# Altium schematic sheet Sheet2.SchDoc
size C; SheetNumber: 1; SheetTotal: 1; SPICEModelCacheQXJCFWAR: <root> / <DocumentId>QXJCFWAR</DocumentId> / <CacheFrame Number="0"> / <Model Name="0603_885012106029_2.2uf" Kind="CKT"> / <Text>******* / .subckt 0603_885012106029_2.2uF 1 2 / Rser 1 3 0.011 / Lser 2 4 0.0000000008 / C1 3 4 0.0000022 / Rpar 3 4 50000000 / .ends 0603_885012106029_2.2uF</Text> / </Model> / <Model Name="npn" Kind="MDL"> / <Text>*Default NPN BJT / *NPN Trans Pinout: C,B,E / .MODEL NPN NPN()</Text> / </Model> / <Model Name="0603_150060rs75003" Kind="CKT"> / <Text>****** / .subckt 0603_150060RS75003  1  2 / D1 1 2 SMCW / .MODEL SMCW D / + IS=1.0025E-15 / + N=2.2259 / + RS=.3926 / + IKF=240.91E-6 / + CJO=1.0000E-12 / + M=.3333 / + VJ=.75 / + BV=5 / + IBV=10.00E-6 / + TT=5.0000E-9 / .ends</Text> / </Model> / </CacheFrame> / </root>
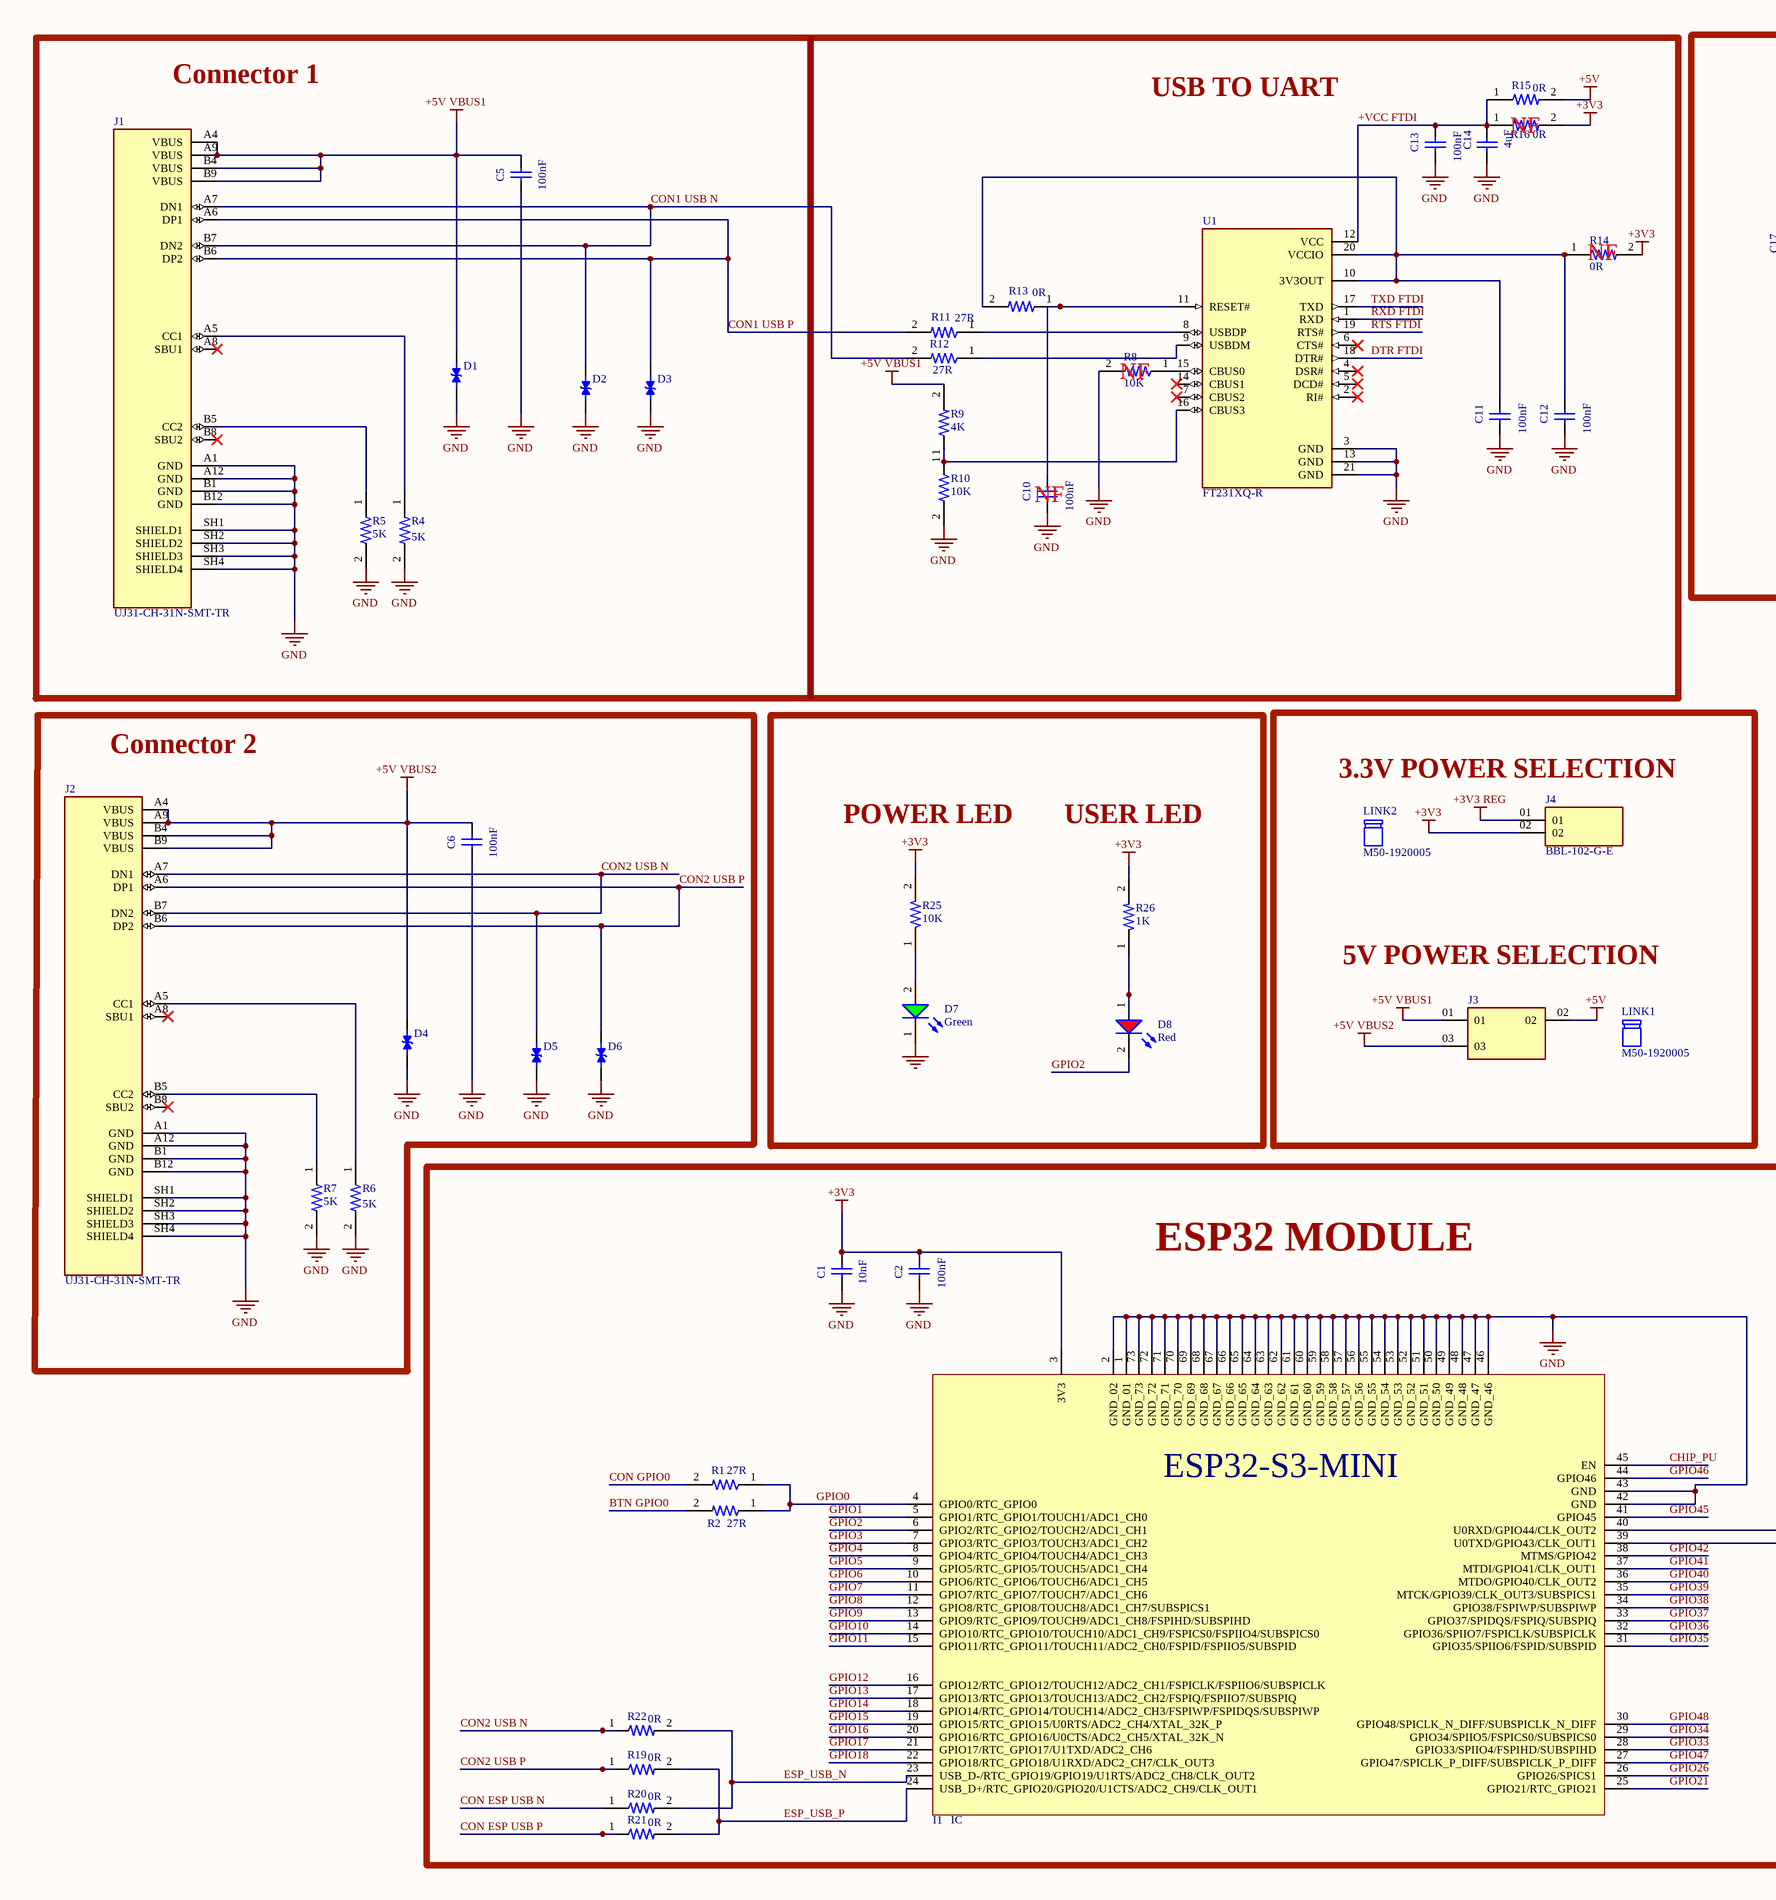
[diagram p0: Sheet2.SchDoc, left]
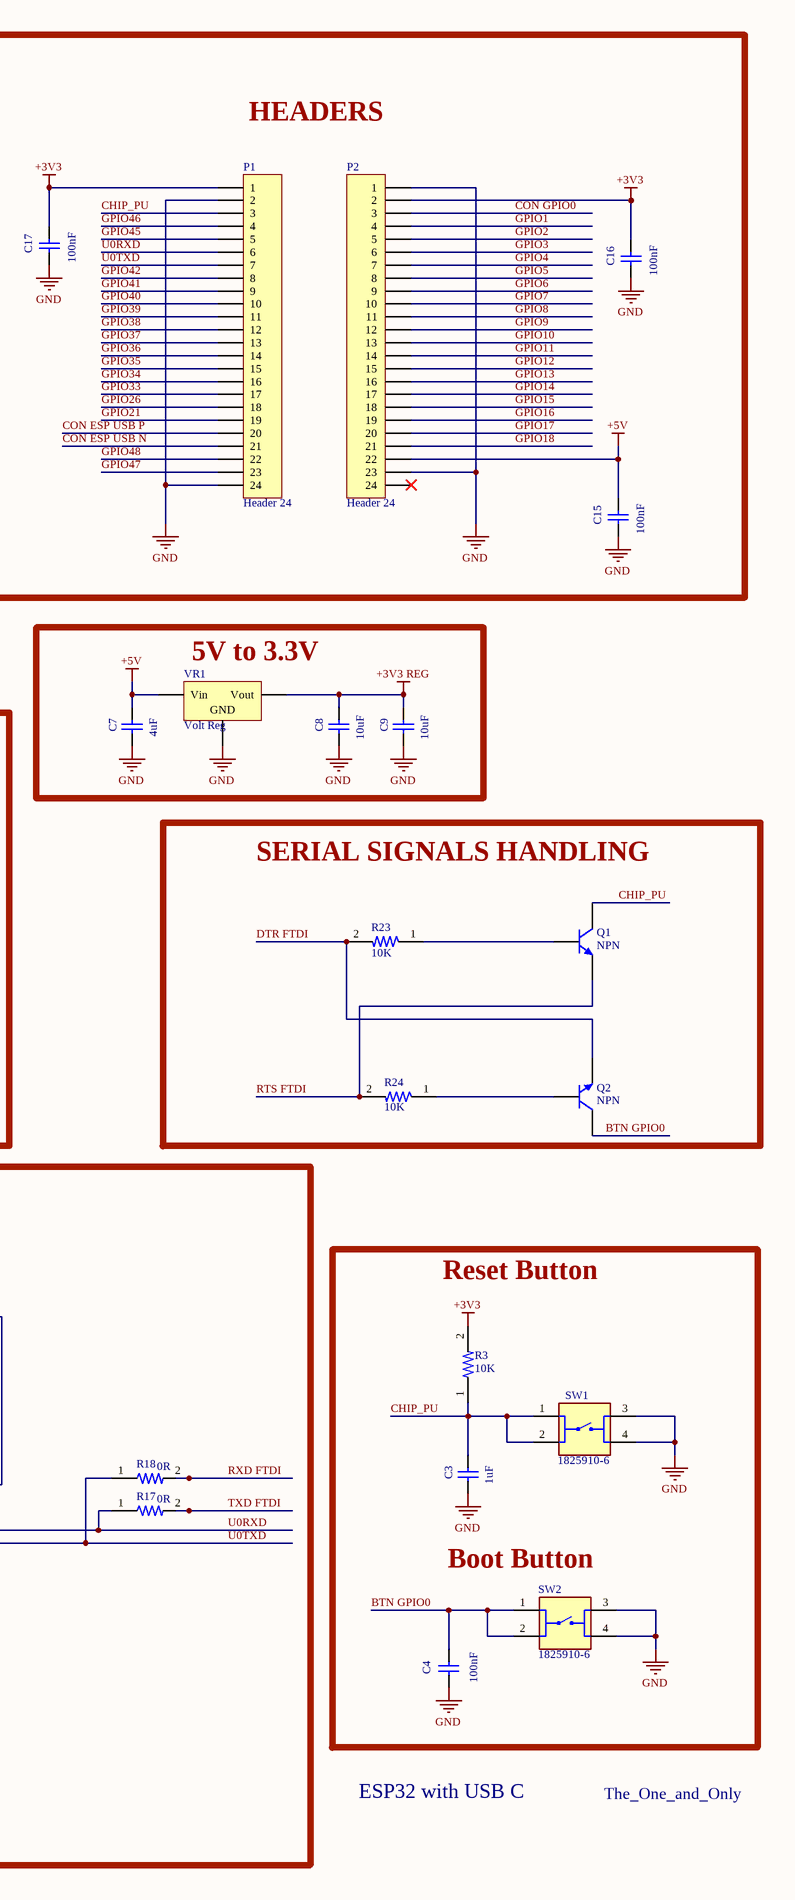
[diagram p1: Sheet2.SchDoc, right]

## Parts
C1  10nF  [WCAP-CSGP_0603_L1.6W0.8H0.8_Reflow]
C2  100nF  [WCAP-CSGP_0603_L1.6W0.8H0.8_Reflow]
C3  1uF  [WCAP-CSGP_0603_L1.6W0.8H0.8_Reflow]
C4  100nF  [WCAP-CSGP_0603_L1.6W0.8H0.8_Reflow]
C5  100nF  [WCAP-CSGP_0603_L1.6W0.8H0.8_Reflow]
C6  100nF  [WCAP-CSGP_0603_L1.6W0.8H0.8_Reflow]
C7  4uF  [WCAP-CSGP_0603_L1.6W0.8H0.8_Reflow]
C8  10uF  [WCAP-CSGP_0603_L1.6W0.8H0.8_Reflow]
C9  10uF  [WCAP-CSGP_0603_L1.6W0.8H0.8_Reflow]
C10  100nF  [WCAP-CSGP_0603_L1.6W0.8H0.8_Reflow]
C11  100nF  [WCAP-CSGP_0603_L1.6W0.8H0.8_Reflow]
C12  100nF  [WCAP-CSGP_0603_L1.6W0.8H0.8_Reflow]
C13  100nF  [WCAP-CSGP_0603_L1.6W0.8H0.8_Reflow]
C14  4uF  [WCAP-CSGP_0603_L1.6W0.8H0.8_Reflow]
C15  100nF  [WCAP-CSGP_0603_L1.6W0.8H0.8_Reflow]
C16  100nF  [WCAP-CSGP_0603_L1.6W0.8H0.8_Reflow]
C17  100nF  [WCAP-CSGP_0603_L1.6W0.8H0.8_Reflow]
D1  TESDU12VRGG  [DIO_TESDU12VRGG]  (value not drawn)
D2  TESDU12VRGG  [DIO_TESDU12VRGG]  (value not drawn)
D3  TESDU12VRGG  [DIO_TESDU12VRGG]  (value not drawn)
D4  TESDU12VRGG  [DIO_TESDU12VRGG]  (value not drawn)
D5  TESDU12VRGG  [DIO_TESDU12VRGG]  (value not drawn)
D6  TESDU12VRGG  [DIO_TESDU12VRGG]  (value not drawn)
D7  Green  [WL-SMCW_0603_150060xx83000]
D8  Red  [WL-SMCW_0603_150060xx75003]
I1  IC  [XCVR_ESP32-MINI-1-N4]
J1  UJ31-CH-31N-SMT-TR  [CUI_UJ31-CH-31N-SMT-TR]
J2  UJ31-CH-31N-SMT-TR  [CUI_UJ31-CH-31N-SMT-TR]
J3  TSW-101-23-S-T  [SAMTEC_TSW-101-23-S-T]  (value not drawn)
J4  BBL-102-G-E  [SAMTEC_BBL-102-G-E]
LINK1  M50-1920005  (mechanical)
LINK2  M50-1920005  (mechanical)
P1  Header 24  [HDR1X24]
P2  Header 24  [HDR1X24]
Q1  NPN  [TO-226-AA]
Q2  NPN  [TO-226-AA]
R1  27R  [RESC1608X50N_CPF0603F10KC1]
R2  27R  [RESC1608X50N_CPF0603F10KC1]
R3  10K  [RESC1608X50N_CPF0603F10KC1]
R4  5K  [RESC1608X50N_CPF0603F10KC1]
R5  5K  [RESC1608X50N_CPF0603F10KC1]
R6  5K  [RESC1608X50N_CPF0603F10KC1]
R7  5K  [RESC1608X50N_CPF0603F10KC1]
R8  10K  [RESC1608X50N_CPF0603F10KC1]
R9  4K  [RESC1608X50N_CPF0603F10KC1]
R10  10K  [RESC1608X50N_CPF0603F10KC1]
R11  27R  [RESC1608X50N_CPF0603F10KC1]
R12  27R  [RESC1608X50N_CPF0603F10KC1]
R13  0R  [RESC1608X50N_CPF0603F10KC1]
R14  0R  [RESC1608X50N_CPF0603F10KC1]
R15  0R  [RESC1608X50N_CPF0603F10KC1]
R16  0R  [RESC1608X50N_CPF0603F10KC1]
R17  0R  [RESC1608X50N_CPF0603F10KC1]
R18  0R  [RESC1608X50N_CPF0603F10KC1]
R19  0R  [RESC1608X50N_CPF0603F10KC1]
R20  0R  [RESC1608X50N_CPF0603F10KC1]
R21  0R  [RESC1608X50N_CPF0603F10KC1]
R22  0R  [RESC1608X50N_CPF0603F10KC1]
R23  10K  [RESC1608X50N_CPF0603F10KC1]
R24  10K  [RESC1608X50N_CPF0603F10KC1]
R25  10K  [RESC1608X50N_CPF0603F10KC1]
R26  1K  [RESC1608X50N_CPF0603F10KC1]
SW1  1825910-6  [SW_1825910-6-4]
SW2  1825910-6  [SW_1825910-6-4]
U1  FT231XQ-R  [QFN50P400X400X80-21N]
VR1  Volt Reg  [D2PAK_N]

## Blocks framed on the sheet
HEADERS: C15-C17 P1 P2
5V to 3.3V: C7-C9 VR1
Connector 2: C6 D4-D6 J2 R6 R7
SERIAL SIGNALS HANDLING: Q1 Q2 R23 R24
ESP32 MODULE: C1 C2 I1 R1 R2 R17-R22

## Nets
+3V3: C1.2 C2.2 C16.2 C17.2 I1.3(3V3) J4.02 P1.1 P2.2 R3.2 R14.2 R16.2 R25.2 R26.2
+3V3 REG: C8.2 C9.2 J4.01 VR1.3(Vout)
+5V: C7.2 C15.2 J3.02 P2.22 R15.2 VR1.1(Vin)
+5V VBUS1: C5.2 D1.2 J1.A4(VBUS) J1.A9(VBUS) J1.B4(VBUS) J1.B9(VBUS) J3.01 R9.2
+5V VBUS2: C6.2 D4.2 J2.A4(VBUS) J2.A9(VBUS) J2.B4(VBUS) J2.B9(VBUS) J3.03
GND: C1.1 C2.1 C3.1 C4.1 C5.1 C6.1 C7.1 C8.1 C9.1 C10.1 C11.1 C12.1 C13.1 C14.1 C15.1 C16.1 C17.1 D1.1 D2.1 D3.1 D4.1 D5.1 D6.1 D7.1(K) I1.1(GND_01) I1.2(GND_02) I1.42(GND) I1.43(GND) I1.46(GND_46) I1.47(GND_47) I1.48(GND_48) I1.49(GND_49) I1.50(GND_50) I1.51(GND_51) I1.52(GND_52) I1.53(GND_53) I1.54(GND_54) I1.55(GND_55) I1.56(GND_56) I1.57(GND_57) I1.58(GND_58) I1.59(GND_59) I1.60(GND_60) I1.61(GND_61) I1.62(GND_62) I1.63(GND_63) I1.64(GND_64) I1.65(GND_65) I1.66(GND_66) I1.67(GND_67) I1.68(GND_68) I1.69(GND_69) I1.70(GND_70) I1.71(GND_71) I1.72(GND_72) I1.73(GND_73) J1.A1(GND) J1.A12(GND) J1.B1(GND) J1.B12(GND) J1.SH1(SHIELD1) J1.SH2(SHIELD2) J1.SH3(SHIELD3) J1.SH4(SHIELD4) J2.A1(GND) J2.A12(GND) J2.B1(GND) J2.B12(GND) J2.SH1(SHIELD1) J2.SH2(SHIELD2) J2.SH3(SHIELD3) J2.SH4(SHIELD4) P1.2 P1.24 P2.1 P2.23 R4.2 R5.2 R6.2 R7.2 R8.2 R10.2 SW1.3 SW1.4 SW2.3 SW2.4 U1.3(GND) U1.13(GND) U1.21(GND) VR1.2(GND)
+VCC FTDI: C13.2 C14.2 R15.1 R16.1 U1.12(VCC)
BTN GPIO0: C4.2 Q2.1(C) R2.2 SW2.1 SW2.2
CHIP_PU: C3.2 I1.45(EN) P1.3 Q1.1(C) R3.1 SW1.1 SW1.2
CON1 USB N: D2.2 J1.A7(DN1) J1.B7(DN2) R12.2
CON1 USB P: D3.2 J1.A6(DP1) J1.B6(DP2) R11.2
CON2 USB N: D5.2 J2.A7(DN1) J2.B7(DN2) R22.1
CON2 USB P: D6.2 J2.A6(DP1) J2.B6(DP2) R19.1
CON ESP USB N: P1.21 R20.1
CON ESP USB P: P1.20 R21.1
CON GPIO0: P2.3 R1.2
DTR FTDI: Q2.3(E) R23.2 U1.18(DTR#)
ESP_USB_N: I1.23(USB_D-/RTC_GPIO19/GPIO19/U1RTS/ADC2_CH8/CLK_OUT2) R20.2 R22.2
ESP_USB_P: I1.24(USB_D+/RTC_GPIO20/GPIO20/U1CTS/ADC2_CH9/CLK_OUT1) R19.2 R21.2
GPIO0: I1.4(GPIO0/RTC_GPIO0) R1.1 R2.1
GPIO1: I1.5(GPIO1/RTC_GPIO1/TOUCH1/ADC1_CH0) P2.4
GPIO2: D8.2(K) I1.6(GPIO2/RTC_GPIO2/TOUCH2/ADC1_CH1) P2.5
GPIO3: I1.7(GPIO3/RTC_GPIO3/TOUCH3/ADC1_CH2) P2.6
GPIO4: I1.8(GPIO4/RTC_GPIO4/TOUCH4/ADC1_CH3) P2.7
GPIO5: I1.9(GPIO5/RTC_GPIO5/TOUCH5/ADC1_CH4) P2.8
GPIO6: I1.10(GPIO6/RTC_GPIO6/TOUCH6/ADC1_CH5) P2.9
GPIO7: I1.11(GPIO7/RTC_GPIO7/TOUCH7/ADC1_CH6) P2.10
GPIO8: I1.12(GPIO8/RTC_GPIO8/TOUCH8/ADC1_CH7/SUBSPICS1) P2.11
GPIO9: I1.13(GPIO9/RTC_GPIO9/TOUCH9/ADC1_CH8/FSPIHD/SUBSPIHD) P2.12
GPIO10: I1.14(GPIO10/RTC_GPIO10/TOUCH10/ADC1_CH9/FSPICS0/FSPIIO4/SUBSPICS0) P2.13
GPIO11: I1.15(GPIO11/RTC_GPIO11/TOUCH11/ADC2_CH0/FSPID/FSPIIO5/SUBSPID) P2.14
GPIO12: I1.16(GPIO12/RTC_GPIO12/TOUCH12/ADC2_CH1/FSPICLK/FSPIIO6/SUBSPICLK) P2.15
GPIO13: I1.17(GPIO13/RTC_GPIO13/TOUCH13/ADC2_CH2/FSPIQ/FSPIIO7/SUBSPIQ) P2.16
GPIO14: I1.18(GPIO14/RTC_GPIO14/TOUCH14/ADC2_CH3/FSPIWP/FSPIDQS/SUBSPIWP) P2.17
GPIO15: I1.19(GPIO15/RTC_GPIO15/U0RTS/ADC2_CH4/XTAL_32K_P) P2.18
GPIO16: I1.20(GPIO16/RTC_GPIO16/U0CTS/ADC2_CH5/XTAL_32K_N) P2.19
GPIO17: I1.21(GPIO17/RTC_GPIO17/U1TXD/ADC2_CH6) P2.20
GPIO18: I1.22(GPIO18/RTC_GPIO18/U1RXD/ADC2_CH7/CLK_OUT3) P2.21
GPIO21: I1.25(GPIO21/RTC_GPIO21) P1.19
GPIO26: I1.26(GPIO26/SPICS1) P1.18
GPIO33: I1.28(GPIO33/SPIIO4/FSPIHD/SUBSPIHD) P1.17
GPIO34: I1.29(GPIO34/SPIIO5/FSPICS0/SUBSPICS0) P1.16
GPIO35: I1.31(GPIO35/SPIIO6/FSPID/SUBSPID) P1.15
GPIO36: I1.32(GPIO36/SPIIO7/FSPICLK/SUBSPICLK) P1.14
GPIO37: I1.33(GPIO37/SPIDQS/FSPIQ/SUBSPIQ) P1.13
GPIO38: I1.34(GPIO38/FSPIWP/SUBSPIWP) P1.12
GPIO39: I1.35(MTCK/GPIO39/CLK_OUT3/SUBSPICS1) P1.11
GPIO40: I1.36(MTDO/GPIO40/CLK_OUT2) P1.10
GPIO41: I1.37(MTDI/GPIO41/CLK_OUT1) P1.9
GPIO42: I1.38(MTMS/GPIO42) P1.8
GPIO45: I1.41(GPIO45) P1.5
GPIO46: I1.44(GPIO46) P1.4
GPIO47: I1.27(GPIO47/SPICLK_P_DIFF/SUBSPICLK_P_DIFF) P1.23
GPIO48: I1.30(GPIO48/SPICLK_N_DIFF/SUBSPICLK_N_DIFF) P1.22
RTS FTDI: Q1.3(E) R24.2 U1.19(RTS#)
RXD FTDI: R18.2 U1.1(RXD)
TXD FTDI: R17.2 U1.17(TXD)
U0RXD: I1.40(U0RXD/GPIO44/CLK_OUT2) P1.6 R17.1
U0TXD: I1.39(U0TXD/GPIO43/CLK_OUT1) P1.7 R18.1
NetC10_2: C10.2 R13.1 U1.11(RESET#)
NetC11_2: C11.2 C12.2 R13.2 R14.1 U1.10(3V3OUT) U1.20(VCCIO)
NetD7_2: D7.2(A) R25.1
NetD8_1: D8.1(A) R26.1
NetJ1_A5: J1.A5(CC1) R4.1
NetJ1_B5: J1.B5(CC2) R5.1
NetJ2_A5: J2.A5(CC1) R6.1
NetJ2_B5: J2.B5(CC2) R7.1
NetQ1_2: Q1.2(B) R23.1
NetQ2_2: Q2.2(B) R24.1
NetR8_1: R8.1 U1.15(CBUS0)
NetR9_1: R9.1 R10.1 U1.16(CBUS3)
NetR11_1: R11.1 U1.8(USBDP)
NetR12_1: R12.1 U1.9(USBDM)

Not connected (* = marked no-connect by the designer): J1 A8(SBU1)* B8(SBU2)*; J2 A8(SBU1)* B8(SBU2)*; P2 24*; U1 2(RI#)* 4(DSR#)* 5(DCD#)* 6(CTS#)* 7(CBUS2)* 14(CBUS1)*

## Notes on the sheet
- Connector 1
- USB TO UART
- (near R16) NF
- (near R14) NF
- (near R8) NF
- (near C10) NF
- 3.3V POWER SELECTION
- POWER LED
- USER LED
- 5V POWER SELECTION
- Reset Button
- (near SW2) Boot Button
- ESP32 with USB C
- The_One_and_Only
- (in symbol Component_1) ESP32-S3-MINI

## Library data of the parts
C1-C17 = 885012106029: WCAP-CSGP Multilayer Ceramic Chip Capacitor, General Purpose, size 0603, X5R, 2.2μF, 16V; Manufacturer: Wurth Elektronik; Case/Size Code: 0603; Capacitance Tolerance: +/-10%; Dissipation Factor: 10%; Insulation Resistance: 0.05GΩ; Technical Reference: X5R0603225K016DFCT10000; Manufacturer Part Number: 885012106029; Category: Multilayer Ceramic Chip Capacitors; Match Code: WCAP-CSGP; ComponentLink1Description: Website Link; ComponentLink1URL: https://www.we-online.com/redexpert/article/885012106029?ad; ComponentLink2Description: Datasheet Link; ComponentLink2URL: https://www.we-online.com/redexpert/spec/885012106029?ad; Mount: Surface Mount; Min Operating Temperature: -55°C; Max Operating Temperature: 85°C; Packaging: Tape and Reel; Length: 1.6mm; Width: 0.8mm; Height: 0.8mm; Capacitance: 2.2μF; Ceramic Type: X5R; Rated Voltage (DC): 16V
D1-D6 = TESDU12VRGG: 33V Clamp 5A Ipp Tvs Diode Surface Mount 0603; MF: Taiwan Semiconductor; SnapEDA_Link: https://www.snapeda.com/parts/TESDU12VRGG/taiwan/view-part/?ref=snap; Package: 0603 Taiwan Semiconductor; Value: *; MP: TESDU12VRGG; Check_prices: https://www.snapeda.com/parts/TESDU12VRGG/taiwan/view-part/?ref=eda
D7 = 150060GS83000: WL-SMCW Mono-color Chip LED Waterclear, SMT, size 0603, Green, 3.3V, 30°; Manufacturer: Wurth Elektronik; Case/Size Code: 0603; Chip Technology: InGaN; Dominant Wavelength: 525nm; Luminous Intensity: 4500mcd; Peak Wavelength: 520nm; Manufacturer Part Number: 150060GS83000; Category: Signal LEDs; Match Code: WL-SMCW; ComponentLink1Description: Website Link; ComponentLink1URL: https://www.we-online.com/redexpert/article/150060GS83000?ad; ComponentLink2Description: Datasheet Link; ComponentLink2URL: https://www.we-online.com/redexpert/spec/150060GS83000?ad; Mount: Surface Mount; Operating Temperature Max: 85°C; Operating Temperature Min: -40°C; Packaging: Tape and Reel; Length: 1.6mm; Width: 0.8mm; Height: 0.95mm; Emitting Color: Green; Forward Voltage: 3.3V; Viewing Angle: 30°
D8 = 150060RS75003: WL-SMCW Mono-color Chip LED Waterclear, SMT, size 0603, Red, 2V, 140°; Manufacturer: Wurth Elektronik; Case/Size Code: 0603; Chip Technology: AlInGaP; Dominant Wavelength: 625nm; Luminous Intensity: 530mcd; Peak Wavelength: 630nm; Manufacturer Part Number: 150060RS75003; Category: Signal LEDs; Match Code: WL-SMCW; ComponentLink1Description: Website Link; ComponentLink1URL: https://www.we-online.com/redexpert/article/150060RS75003?ad; ComponentLink2Description: Datasheet Link; ComponentLink2URL: https://www.we-online.com/redexpert/spec/150060RS75003?ad; Mount: Surface Mount; Operating Temperature Max: 100°C; Operating Temperature Min: -40°C; Packaging: Tape and Reel; Length: 1.6mm; Width: 0.8mm; Height: 0.7mm; Emitting Color: Red; Forward Voltage: 2V; Viewing Angle: 140°
I1 = Component_1
J1 J2 = UJ31-CH-31N-SMT-TR: Type C, USB 3.1 Gen 2, 5 A, Right Angle, Surface Mount (SMT), USB Receptacle; MF: CUI Devices; Availability: In Stock; Package: None; MP: UJ31-CH-31N-SMT-TR; Value: *; Purchase-URL: https://pricing.snapeda.com/search/part/UJ31-CH-31N-SMT-TR/?ref=eda; Check_prices: https://www.snapeda.com/parts/UJ31-CH-31N-SMT-TR/CUI+Devices/view-part/?ref=eda; CUI_purchase_URL: https://www.cuidevices.com/product/interconnect/connectors/usb-connectors/uj31-ch-smt-series?utm_source=snapeda.com&utm_medium=referral&utm_campaign=snapedaBOM; Price: None; SnapEDA_Link: https://www.snapeda.com/parts/UJ31-CH-31N-SMT-TR/CUI+Devices/view-part/?ref=snap
LINK1 LINK2 = M50-1920005: CONN SHUNT 1.27MM RED; Manufacturer: Harwin; Manufacturer Series: M50; Connector Type: Interconnection Device; Body/Shell Style: PLUG; Contact Pattern: RECTANGULAR; Contact Resistance: 20mR; Durability: 300Cycles; Insulation Resistance: 1GR; Number Of Connectors: 1; Rated Current (Signal): 1A; Number of Contacts: 2; Dielectric Withstanding Voltage (AC): 500V; Body Breadth: 0.059inch; Body Length: 0.098inch; Mating Contact Pitch: 0.05inch; Body Depth: 0.118inch; Reference Standard: UL; Reliability: COMMERCIAL; Supplier: Digikey; Supplier Part Number: 952-1727-ND; Manufacturer Part Number: M50-1920005; RoHS: Yes; Category: Headers and Wire Housings; Stock: 4401; Pricing: 1=0.43, 10=0.363, 25=0.3196, 50=0.2936, 100=0.2821, 250=0.25332, 500=0.2418, 1000=0.2015, 2500=0.18422 (USD); Contact Finish - Mating: AU ON NI; Contact Finish - Termination: Gold (Au); Insulation Color: Red; Insulation Material: Nylon; Contact Material: Copper Alloy; Min Operating Temperature: -40°C; Max Operating Temperature: 105°C; JESD-609 Code: e4; Contact Gender: Female; Mounting Style: STRAIGHT; Number of Rows Loaded: 1; Reach SVHC Compliant: Yes; RoHS Compliant: Yes; ComponentLink1URL: https://datasheet.ciiva.com:443/pdfs/VipMasterIC/IC/HRWN/HRWNS04645/HRWNS04645-1.pdf?src-supplier=IHS+Markit; ComponentLink1Description: https://datasheet.ciiva.com:443/pdfs/VipMasterIC/IC/HRWN/HRWNS04645/HRWNS04645-1.pdf?src-supplier=IHS+Markit; ComponentLink2URL: https://datasheet.ciiva.com/4573/m50-19x-350826-4573042.pdf?src-supplier=Mouser; ComponentLink2Description: https://datasheet.ciiva.com/4573/m50-19x-350826-4573042.pdf?src-supplier=Mouser; ComponentLink3URL: https://datasheet.ciiva.com/1412/1836978-1412125.pdf?src-supplier=Element14; ComponentLink3Description: https://datasheet.ciiva.com/1412/1836978-1412125.pdf?src-supplier=Element14; ComponentLink4URL: https://datasheet.ciiva.com/767/m50-19x-767921.pdf?src-supplier=Digikey; ComponentLink4Description: https://datasheet.ciiva.com/767/m50-19x-767921.pdf?src-supplier=Digikey; ComponentLink5URL: https://datasheet.ciiva.com/1456/m50-19x-1456640.pdf?src-supplier=Newark; ComponentLink5Description: https://datasheet.ciiva.com/1456/m50-19x-1456640.pdf?src-supplier=Newark; LCSC Part Number: C6985646
P1 P2 = Header 24: Header, 24-Pin; LatestRevisionDate: 17-Jul-2002; LatestRevisionNote: Re-released for DXP Platform.; Publisher: Altium Limited
Q1 Q2 = NPN: NPN Bipolar Transistor; Published: 8-Jun-2000; LatestRevisionDate: 17-Jul-2002; LatestRevisionNote: Re-released for DXP Platform.; PackageReference: TO-226-AA; Publisher: Altium Limited; PackageDescription: TO, Flat Index; 3 In-Line, Axial Leads; Body Dia. 4.8mm; Leads 0.55 x 0.51 mm (max); Code_JEDEC: TO-226-AA
R1-R26 = CPF0603F10KC1: Res Thin Film 0603 10K Ohm 1% 1/16W Â±50ppm/Â°C Molded SMD SMD Paper T/R; MF: TE Connectivity; Voltage_Rating: 50 V; Power_Rating: .063 W; Tolerance: 1%; Price: None; SnapEDA_Link: https://www.snapeda.com/parts/CPF0603F10KC1/TE+Connectivity+Passive+Product/view-part/?ref=snap; Resistance: 10K; Check_prices: https://www.snapeda.com/parts/CPF0603F10KC1/TE+Connectivity+Passive+Product/view-part/?ref=eda; EU_RoHS_Compliance: Compliant; Purchase-URL: https://pricing.snapeda.com/search/part/CPF0603F10KC1/?ref=eda; Availability: In Stock; Package: 0603; MP: CPF0603F10KC1; Value: *
SW1 SW2 = 1825910-6: Switch Push Button OFF (ON) SPST Round Button 0.05A 24VDC Momentary Contact PC Pins Thru-Hole; MF: TE Connectivity; Value: *; MP: 1825910-6; Package: None; Check_prices: https://www.snapeda.com/parts/1825910-6/TE+Connectivity+ALCOSWITCH+Switches/view-part/?ref=eda; SnapEDA_Link: https://www.snapeda.com/parts/1825910-6/TE+Connectivity+ALCOSWITCH+Switches/view-part/?ref=snap; Digi-Key_Part_Number: 450-1650-ND; Purchase-URL: https://pricing.snapeda.com/search/part/1825910-6/?ref=eda
U1 = FT231XQ-R: USB2.0 Full Speed IC offers a compact bridge to full handshake UART Interface; Package: None; Price: None; Availability: Unavailable; MP: FT231XQ-R; Value: *
VR1 = Volt Reg: Voltage Regulator; Published: 24-Mar-1999; LatestRevisionDate: 29-May-2009; LatestRevisionNote: IPC-7351 Footprint Added.; PackageReference: D2PAK; Publisher: Altium Limited; PackageDescription: 3-Pin Transistor Outline Package 2.54 mm Pitch, 15.1 mm Lead Span
J3 = TSW-101-23-S-T: Package: None; Price: None; Value: *; MP: TSW-101-23-S-T; Availability: Unavailable
J4 = BBL-102-G-E: Availability: Unavailable; MP: BBL-102-G-E; Value: *; Price: None; Package: None